# Altium schematic sheet 2. MCU.SchDoc
size A4
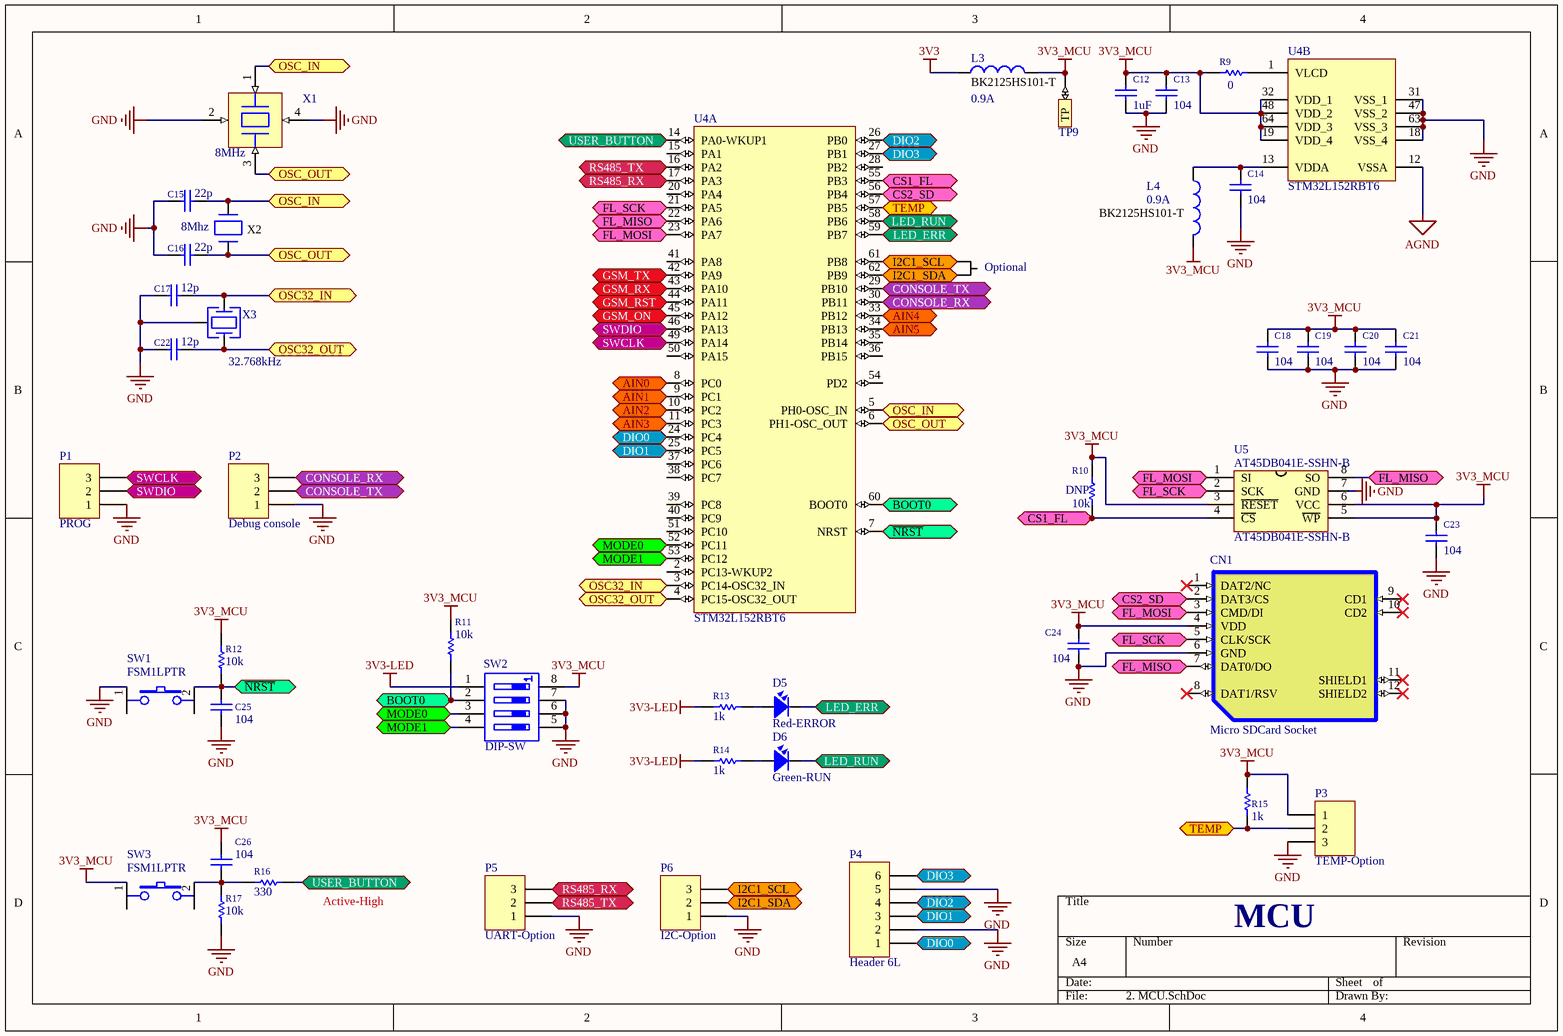
[diagram p0: 2. MCU.SchDoc]

## Parts
C12  value 1uF  [SM-0805 CAP]  (hidden comment: 1u)
C13  104  [sm-0603-c]
C14  104  [sm-0603-c]
C15  22p  [sm-0603-c]
C16  22p  [sm-0603-c]
C17  12p  [sm-0603-c]
C18  104  [sm-0603-c]
C19  104  [sm-0603-c]
C20  104  [sm-0603-c]
C21  104  [sm-0603-c]
C22  12p  [sm-0603-c]
C23  104  [sm-0603-c]
C24  104  [sm-0603-c]
C25  104  [sm-0603-c]
C26  104  [sm-0603-c]
CN1  Micro SDCard Socket  [MicroSD-3]
D5  Red-ERROR  [LED0603]
D6  Green-RUN  [LED0603]
L3  Current: 0.9A  [L2012-0805]  (hidden comment: BK2125HS101-T)
L4  Current: 0.9A  [L2012-0805]  (hidden comment: BK2125HS101-T)
P1  PROG  [HEADER 3PIN.CAOVANHUONG]
P2  Debug console  [HEADER 3PIN.CAOVANHUONG]
P3  TEMP-Option  [HEADER 3PIN.CAOVANHUONG]
P4  Header 6L  [HDR1X6 - L]
P5  UART-Option  [HEADER 3PIN.CAOVANHUONG]
P6  I2C-Option  [HEADER 3PIN.CAOVANHUONG]
R9  value 0  [SM-0603-R]  (hidden comment: 10k)
R10  10k  [SM-0603-R]
R11  10k  [SM-0603-R]
R12  10k  [SM-0603-R]
R13  1k  [SM-0603-R]
R14  1k  [SM-0603-R]
R15  1k  [SM-0603-R]
R16  value 330  [SM-0603-R]  (hidden comment: 10k)
R17  10k  [SM-0603-R]
SW1  FSM1LPTR  [BUTTON-SMD 2PIN.CAOVANHUONG]
SW2  value DIP-SW  [SW-DIP4]  (hidden comment: 208-4)
SW3  FSM1LPTR  [BUTTON-SMD 2PIN.CAOVANHUONG]
TP9  4V3  [TP]  (value not drawn)  (no BOM)
U4  STM32L152RBT6  [LQFP64_N]  (parts A,B of 2)
U5  AT45DB041E-SSHN-B  [SOIC8]
X1  8MHz  [Crystal.ECX-3S]
X2  8Mhz  [Crystal.HC49_N]
X3  32.768kHz  [Crystal cylinder]

## Ports
AIN0, AIN1, AIN2, AIN3, AIN4, AIN5, BOOT0 (bidir), CONSOLE_RX, CONSOLE_TX, CS1_FL, CS2_SD, DIO0, DIO1, DIO2, DIO3, FL_MISO, FL_MOSI, FL_SCK, GSM_ON, GSM_RST, GSM_RX, GSM_TX, I2C1_SCL, I2C1_SDA, LED_ERR, LED_RUN, MODE0, MODE1, OSC32_IN, OSC32_OUT, OSC_IN, OSC_OUT, RS485_RX, RS485_TX, SWCLK, SWDIO, TEMP, USER_BUTTON, ~{NRST}

## Nets
3V3: L3.1
3V3-LED: R13.2 R14.2 SW2.1(A1)
3V3_MCU: C12.1 C13.1 C18.1 C19.1 C20.1 C21.1 C23.1 C24.1 C26.2 CN1.4(VDD) L3.2 L4.2 P3.1 R9.2 R10.2 R11.2 R12.2 R15.1 SW2.8(B1) SW3.1 TP9.1(TP) U4.19(VDD_4) U4.32(VDD_1) U4.48(VDD_2) U4.64(VDD_3) U5.3(~{RESET}) U5.5(~{WP}) U5.6(VCC)
AGND: U4.12(VSSA)
GND: C12.2 C13.2 C14.2 C15.1 C16.1 C17.1 C18.2 C19.2 C20.2 C21.2 C22.1 C23.2 C24.2 C25.2 CN1.6(GND) P1.1 P2.1 P3.3 P4.2 P4.5 P5.1 P6.1 R17.1 SW1.1 SW2.5(B4) SW2.6(B3) SW2.7(B2) U4.18(VSS_4) U4.31(VSS_1) U4.47(VSS_2) U4.63(VSS_3) U5.7(GND) X1.2 X1.4 X3.3(GND)
AIN0: U4.8(PC0) ; port AIN0
AIN1: U4.9(PC1) ; port AIN1
AIN2: U4.10(PC2) ; port AIN2
AIN3: U4.11(PC3) ; port AIN3
AIN4: U4.33(PB12) ; port AIN4
AIN5: U4.34(PB13) ; port AIN5
BOOT0: R11.1 SW2.2(A2) U4.60(BOOT0) ; port BOOT0
CONSOLE_RX: P2.3 U4.30(PB11) ; port CONSOLE_RX
CONSOLE_TX: P2.2 U4.29(PB10) ; port CONSOLE_TX
CS1_FL: R10.1 U4.55(PB3) U5.4(~{CS}) ; port CS1_FL
CS2_SD: CN1.2(DAT3/CS) U4.56(PB4) ; port CS2_SD
DIO0: P4.1 U4.24(PC4) ; port DIO0
DIO1: P4.3 U4.25(PC5) ; port DIO1
DIO2: P4.4 U4.26(PB0) ; port DIO2
DIO3: P4.6 U4.27(PB1) ; port DIO3
FL_MISO: CN1.7(DAT0/DO) U4.22(PA6) U5.8(SO) ; port FL_MISO
FL_MOSI: CN1.3(CMD/DI) U4.23(PA7) U5.1(SI) ; port FL_MOSI
FL_SCK: CN1.5(CLK/SCK) U4.21(PA5) U5.2(SCK) ; port FL_SCK
GSM_ON: U4.45(PA12) ; port GSM_ON
GSM_RST: U4.44(PA11) ; port GSM_RST
GSM_RX: U4.43(PA10) ; port GSM_RX
GSM_TX: U4.42(PA9) ; port GSM_TX
I2C1_SCL: P6.3 U4.61(PB8) ; port I2C1_SCL
I2C1_SDA: P6.2 U4.62(PB9) ; port I2C1_SDA
LED_ERR: D5.2 U4.59(PB7) ; port LED_ERR
LED_RUN: D6.2 U4.58(PB6) ; port LED_RUN
MODE0: SW2.3(A3) U4.52(PC11) ; port MODE0
MODE1: SW2.4(A4) U4.53(PC12) ; port MODE1
~{NRST}: C25.1 R12.1 SW1.2 U4.7(NRST) ; port ~{NRST}
OSC32_IN: C17.2 U4.3(PC14-OSC32_IN) X3.1 ; port OSC32_IN
OSC32_OUT: C22.2 U4.4(PC15-OSC32_OUT) X3.2 ; port OSC32_OUT
OSC_IN: C15.2 U4.5(PH0-OSC_IN) X1.1 X2.1 ; port OSC_IN
OSC_OUT: C16.2 U4.6(PH1-OSC_OUT) X1.3 X2.2 ; port OSC_OUT
RS485_RX: P5.3 U4.17(PA3) ; port RS485_RX
RS485_TX: P5.2 U4.16(PA2) ; port RS485_TX
SWCLK: P1.3 U4.49(PA14) ; port SWCLK
SWDIO: P1.2 U4.46(PA13) ; port SWDIO
TEMP: P3.2 R15.2 U4.57(PB5) ; port TEMP
USER_BUTTON: R16.1 U4.14(PA0-WKUP1) ; port USER_BUTTON
NetC14_1: C14.1 L4.1 U4.13(VDDA)
NetC26_1: C26.1 R16.2 R17.2 SW3.2
NetD5_1: D5.1 R13.1
NetD6_1: D6.1 R14.1
NetR9_1: R9.1 U4.1(VLCD)

Not connected (* = marked no-connect by the designer): CN1 1(DAT2/NC)* 8(DAT1/RSV)* 9(CD1)* 10(CD2)* 11(SHIELD1)* 12(SHIELD2)*; U4 2(PC13-WKUP2) 15(PA1) 20(PA4) 28(PB2) 35(PB14) 36(PB15) 37(PC6) 38(PC7) 39(PC8) 40(PC9) 41(PA8) 50(PA15) 51(PC10) 54(PD2)

## Notes on the sheet
- Optional
- (near R16) Active-High
- MCU

## Library data of the parts
C12 = Capacitor: CAP CER 1UF 16V X7R 0805; Manufacturer: KEMET; Manufacturer P/N: C0805C105J4RAC7025; Vendor: DIGIKEY; Vendor P/N: 399-7342-1-N; Tollerance: 5%; Voltage: 16V; Part: 1u; Package: 0805; Power: *; DNP: *
C13 C14 C18-C21 C23-C26 = Capacitor: CAP CER 10000PF 16V 0603; Manufacturer: Taiyo Yuden; Manufacturer P/N: EMK107SD103JA-T; Vendor: DIGIKEY; Vendor P/N: 587-1093-1-ND; Package: 0603; Part: EMK107SD103JA-T; Value: 104; Voltage: 16V
C15 C16 = Capacitor: CAP CER 22PF 25V C0G/NP0 0603; Manufacturer: KEMET; Manufacturer P/N: C0603C220J3GACAUTO; Vendor: DIGIKEY; Vendor P/N: 399-6864-1-ND; Tollerance: 1%; Voltage: 25V; Part: 22p; Value: 22p; Package: 0603
C17 C22 = Capacitor: CAP CER 12PF 25V C0G/NP0 0201; Manufacturer: KEMET; Manufacturer P/N: CBR02C120F3GAC; Vendor: DIGIKEY; Vendor P/N: 399-8604-1-ND; Tollerance: 1%; Voltage: 25V; Part: 12p; Value: 12p; Package: 0603
CN1 = MicroSDCard Socket: ComponentLink2Description: Open DataSheet; ComponentLink2URL: H:\LIBRARY\LIBRARY.Datasheet\; Date of Price: 19/11/2010; Price: 5000 VND
D5 D6 = LED: LED Single colour Green and Red; Manufacturer: Unknow; Value: LED 3 ly Single Colour; DNP: DNP; Manufacturer P/N: Unknow; Package: Unknow; Part: Unknow; Price: Unknow; Voltage: Unknow; Vendor: Unknow; Vendor P/N: Unknow; Current: Unknow
L3 L4 = Inductor: FERRITE BEAD 100 OHM 0805 1LN; Manufacturer: Taiyo Yuden; Vendor: DIGIKEY; Vendor P/N: 587-1903-1-ND; Res: 100 OHM; Value: BK2125HS101-T; DNP: *; Manufacturer P/N: BK2125HS101-T; Package: 0805; Part: BK2125HS101-T; Price: *
P1-P3 P5 P6 = Header 3: Header, 3-Pin; LatestRevisionDate: 17-Jul-2002; LatestRevisionNote: Re-released for DXP Platform.; Publisher: Altium Limited
P4 = Header 6L: Header, 6-Pin; LatestRevisionDate: 17-Jul-2002; LatestRevisionNote: Re-released for DXP Platform.; Publisher: Altium Limited
R9-R12 R16 R17 = Resistor: RES SMD 10K OHM 5% 1/10W 0603; Manufacturer: Panasonic Electronic Components; Manufacturer P/N: ERJ-3GEYJ103V; Vendor: DIGIKEY; Vendor P/N: P10KGCT-ND; Tollerance: 5%; Part: 10k; Package: 0603; Power: 1/10W
  R9 R16: DNP: *
  R10: Value: 10k; DNP: DNP
  R11 R12 R17: Value: 10k; DNP: *
R13-R15 = Resistor: RES SMD 1K OHM 5% 1/10W 0603; Manufacturer: Panasonic Electronic Components; Manufacturer P/N: ERJ-3GEYJ102V; Vendor: DIGIKEY; Vendor P/N: P1.0KGCT-ND; Tollerance: 5%; Part: 1k; Value: 1k; Package: 0603; Power: 1/10W; DNP: *
SW1 SW3 = SW PUSHBUTTON-SPST-2/SM: SWITCH TACTILE SPST-NO 0.05A 24V; Manufacturer: TE Connectivity ALCOSWITCH Switches; Vendor: DIGIKEY; Vendor P/N: 450-1756-1-ND; Manufacturer P/N: FSM1LPTR; Part: SW TACT-SPST-2; Value: FSM1LPTR; DNP: *; Package: 6mmx6mmx3.1mm
SW2 = SWDIP-4: SWITCH SLIDE DIP SPST 50MA 24V; Manufacturer: CTS Electrocomponents; Vendor: DIGIKEY; Vendor P/N: CT2084-ND; Manufacturer P/N: 208-4; Package: *; DNP: *; Part: 208-4; Price: *
TP9 = TP: Test Point
U4 = STM32L152RBT6: ARM Cortex-M3 32-bit MCU, 128 KB Flash, 16 KB Internal RAM, 51 I/Os, 64-pin LQFP, -40 to 85 degC, Tray; Manufacturer: STMicroelectronics; D/A Converter: 2x12-bit (2 Channel); Data E2PROM nom (B): 4096; FLASH Size (Prog) (kB): 128; I/Os (High Current): 51; Internal RAM Size (kB): 16; Operating Frequency(F) (Processor speed) (MHz): 32; Supply Voltage(Vcc) min (V): 1.65; DatasheetVersion: Rev. 8; PackageVersion: Rev. 4, 06/2013; PackageReference: LQFP64; PackageDescription: 64-Pin Low Profile Quad Flat Package, 10 x 10 mm Body, 0.5 mm Pitch; Core: ARM Cortex-M3; Packing: Tray; Mounting Technology: Surface Mount; PartNumber: STM32L152RBT6; ComponentLink1Description: Manufacturer URL; ComponentLink1URL: http://www.st.com/web/en/home.html; ComponentLink2Description: Datasheet; ComponentLink2URL: http://www.st.com/st-web-ui/static/active/en/resource/technical/document/datasheet/CD00277537.pdf; ComponentLink3Description: Package Specification; ComponentLink3URL: http://www.st.com/st-web-ui/static/active/en/resource/technical/document/datasheet/DM00037051.pdf
U5 = AT45DB011: IC FLASH 4MBIT 85MHZ 8SOIC; Manufacturer: Adesto Technologies; Vendor: DIGIKEY; Vendor P/N: 1265-1067-5-ND; Part: AT45DB041E-SSHN-B; Value: AT45DB041E-SSHN-B; Manufacturer P/N: AT45DB041E-SSHN-B; Package: SOIC8; Tollerance: *
X1 = Crystal SMD: CRYSTAL 8.0000MHZ 18PF SMD; Manufacturer: Diodes Incorporated; Manufacturer P/N: FY0800027; Vendor: DIGIKEY; Vendor P/N: FY0800027CT-ND; Tollerance: ±20ppm; Part: 8MHz; Value: 8MHz; Package: 5.00mm x 3.20mm; Load Capacitance: 18pF
X2 = Crystal: CRYSTAL 8.0000MHZ 18PF TH; Manufacturer: Taiwan; Manufacturer P/N: HC-49S; Vendor: TME; Tollerance: ±30ppm; Vendor P/N: HC-49S; Part: 8Mhz; Value: 8Mhz; Package: 11.05x4.65x3.7mm; Load Capacitance: 18pF
X3 = Crystal Cylinder: CRYSTAL 32.7680KHZ 12.5PF SMD; Manufacturer: ECS Inc.; Manufacturer P/N: ECS-.327-12.5-13FLX-C; Vendor: DIGIKEY; Vendor P/N: XC1911CT-ND; Tollerance: ±10ppm; Value: 32.768kHz; Package: 2.00mm x 6.10mm; Part: 32.768kHz; DNP: *; Load Capacitance: 12.5pF